# Altium schematic sheet Sheet1.SchDoc
size 177 x 127 mm; SheetNumber: 1; SheetTotal: 1
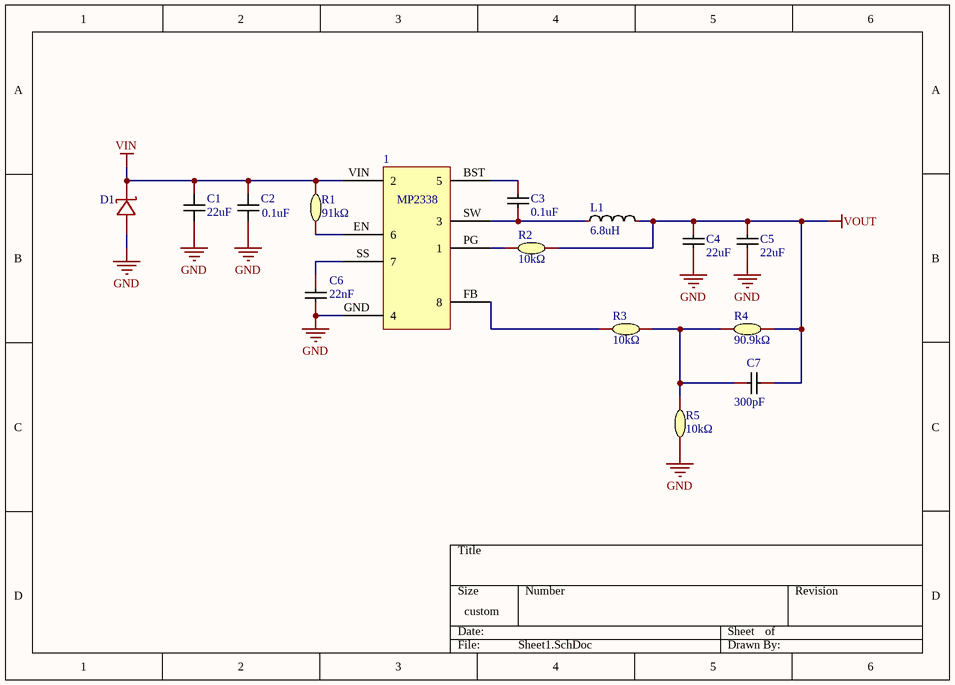
[diagram p0: Sheet1.SchDoc]

## Parts
1  MP2338  [PCBComponent_1]
*  D1  [PCBComponent_1]
C1  22uF  [C0805]
C2  0.1uF  [C0805]
C3  0.1uF  [C0603]
C4  22uF  [C0603]
C5  22uF  [C0603]
C6  22nF  [C0603]
C7  300pF  [C0603]
L1  6.8uH  [IND-SMD_L7.0-W6.6]
R1  191kΩ  [R0603]
R2  10kΩ  [R0603]
R3  10kΩ  [R0603]
R4  90.9kΩ  [R0603]
R5  10kΩ  [R0603]

## Nets
GND: 1.GND(4) *.2(A) C1.1 C2.1 C4.1 C5.1 C6.1 R5.1
VIN: 1.VIN(2) *.1(K) C1.2 C2.2 R1.2
VOUT: C4.2 C5.2 C7.2 L1.2 R2.2 R4.2
Net1_BST: 1.BST(5) C3.2
Net1_EN: 1.EN(6) R1.1
Net1_FB: 1.FB(8) R3.1
Net1_PG: 1.PG(1) R2.1
Net1_SS: 1.SS(7) C6.2
Net1_SW: 1.SW(3) C3.1 L1.1
NetC7_1: C7.1 R3.2 R4.1 R5.2

## Library data of the parts
* = Component_1
C1 C2 = CL21A226MAQNNNE_C45783: 容值:22uF;精度:±20%;额定电压:25V;材质(温度系数):X5R;; Manufacturer: SAMSUNG(三星); Add into BOM: yes; Tolerance: ±20%; Voltage Rated: 25V; Temperature Coefficient: X5R; Symbol: CL21A226MAQNNNE; Device: CL21A226MAQNNNE_C45783; LCSC Part Name: 22uF ±20% 25V; Supplier Part: C45783; Manufacturer Part: CL21A226MAQNNNE; Supplier Footprint: 0805; JLCPCB Part Class: 基础库; Datasheet: https://atta.szlcsc.com/upload/public/pdf/source/20160103/1457707727161.pdf; Supplier: LCSC; Convert to PCB: yes
  C1: Value: 22uF; Name: 22uF
  C2: Value: 0.1uF; Name: 0.1uF
C3-C7 = CL10A225KO8NNNC: 容值:2.2uF;精度:±10%;额定电压:16V;材质(温度系数):X5R;; Manufacturer: SAMSUNG(三星); Add into BOM: yes; Tolerance: ±10%; Voltage Rated: 16V; Temperature Coefficient: X5R; Symbol: CL10A225KO8NNNC; Device: CL10A225KO8NNNC; LCSC Part Name: 2.2uF ±10% 16V; Supplier Part: C23630; Manufacturer Part: CL10A225KO8NNNC; Supplier Footprint: 0603; JLCPCB Part Class: 基础库; Datasheet: https://atta.szlcsc.com/upload/public/pdf/source/20160103/1457707709512.pdf; Supplier: LCSC; Convert to PCB: yes
  C3: Value: 0.1uF; Name: 0.1uF
  C4 C5: Value: 22uF; Name: 22uF
  C6: Value: 22nF; Name: 22nF
  C7: Value: 300pF; Name: 300pF
L1 = MWSA0603S-2R2MT: 电感值:2.2uH;精度:±20%;额定电流:9.5A;直流电阻(DCR):15mΩ;; Manufacturer: Sunlord(顺络); Add into BOM: yes; Tolerance: ±20%; Rated Current: 9.5A; DC Resistance (DCR): 15mΩ; Symbol: MWSA0603S-2R2MT; Device: MWSA0603S-2R2MT; LCSC Part Name: 2.2uH ±20% 9.5A 15mΩ; Supplier Part: C408445; Manufacturer Part: MWSA0603S-2R2MT; Supplier Footprint: SMD; JLCPCB Part Class: 扩展库; Datasheet: https://atta.szlcsc.com/upload/public/pdf/source/20190729/C408445_4286F301FFB17FE93B4CE8B15A01B108.pdf; Supplier: LCSC; Convert to PCB: yes; Value: 6.8uH; Name: 6.8uH
R1-R5 = 0603WAF1002T5E: 电阻类型:厚膜电阻;阻值:10kΩ;精度:±1%;功率:100mW;温度系数:±100ppm/℃;最大工作电压:75V;工作温度范围:-55℃~+155℃;; Manufacturer: UNI-ROYAL(厚声); Add into BOM: yes; Tolerance: ±1%; Power(Watts): 100mW; Overload Voltage (Max): 75V; Symbol: 0603WAF1002T5E; Device: 0603WAF1002T5E; LCSC Part Name: 10kΩ ±1% 100mW; Supplier Part: C25804; Manufacturer Part: 0603WAF1002T5E; Supplier Footprint: 0603; JLCPCB Part Class: 基础库; Datasheet: https://atta.szlcsc.com/upload/public/pdf/source/20200306/C422600_1E6D84923E4A46A82E41ADD87F860B5C.pdf; Supplier: LCSC; Convert to PCB: yes; Type: 厚膜电阻; Temperature Coefficient: ±100ppm/℃; Operating Temperature Range: -55℃~+155℃
  R1: Value: 191kΩ; Name: 191kΩ
  R2 R3 R5: Value: 10kΩ; Name: 10kΩ
  R4: Value: 90.9kΩ; Name: 90.9kΩ